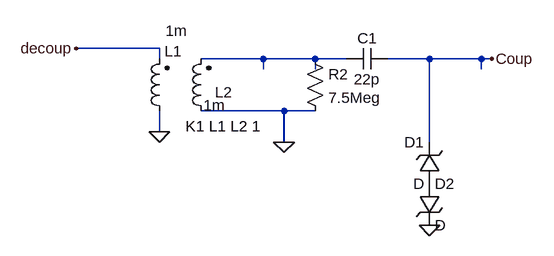
[diagram p0: schematic Coupling_Block.asc]
Coupling_Block.asc, the LTspice schematic file:
Version 4
SHEET 1 880 680
WIRE 0 128 -128 128
WIRE 0 144 0 128
WIRE 160 144 64 144
WIRE 240 144 160 144
WIRE 288 144 240 144
WIRE 416 144 352 144
WIRE 496 144 416 144
WIRE 512 144 496 144
WIRE 160 160 160 144
WIRE 240 160 240 144
WIRE 496 160 496 144
WIRE 192 224 64 224
WIRE 240 224 192 224
WIRE 0 256 0 224
WIRE 192 272 192 224
WIRE 416 272 416 144
FLAG 192 272 0
FLAG 0 256 0
FLAG 512 144 Coup
FLAG -128 128 decoup
FLAG 416 400 0
SYMBOL ind2 16 240 R180
WINDOW 0 -19 108 Left 2
WINDOW 3 -27 139 Left 2
SYMATTR InstName L1
SYMATTR Value 1m
SYMATTR Type ind
SYMATTR SpiceLine Rser=.1
SYMBOL ind2 80 240 R180
WINDOW 0 -33 45 Left 2
WINDOW 3 -22 25 Left 2
SYMATTR InstName L2
SYMATTR Value 1m
SYMATTR Type ind
SYMBOL cap 352 128 R90
WINDOW 0 0 32 VBottom 2
WINDOW 3 32 32 VTop 2
SYMATTR InstName C1
SYMATTR Value 22p
SYMBOL res 224 128 R0
SYMATTR InstName R2
SYMATTR Value 7.5Meg
SYMBOL zener 432 336 R180
WINDOW 0 24 64 Left 2
WINDOW 3 24 0 Left 2
SYMATTR InstName D1
SYMBOL zener 400 336 R0
SYMATTR InstName D2
TEXT 40 248 Left 2 !K1 L1 L2 1

The netlist it stands for:
* Coupling_Block.asc
L1 0 decoup 1m Rser=.1
L2 0 N001 1m
C1 Coup N001 22p
R2 N001 0 7.5Meg
D1 P001 Coup D
D2 P001 0 D
.model D D
.lib standard.dio
K1 L1 L2 1
.backanno
.end